# Altium project NautilusKB.PrjPcb
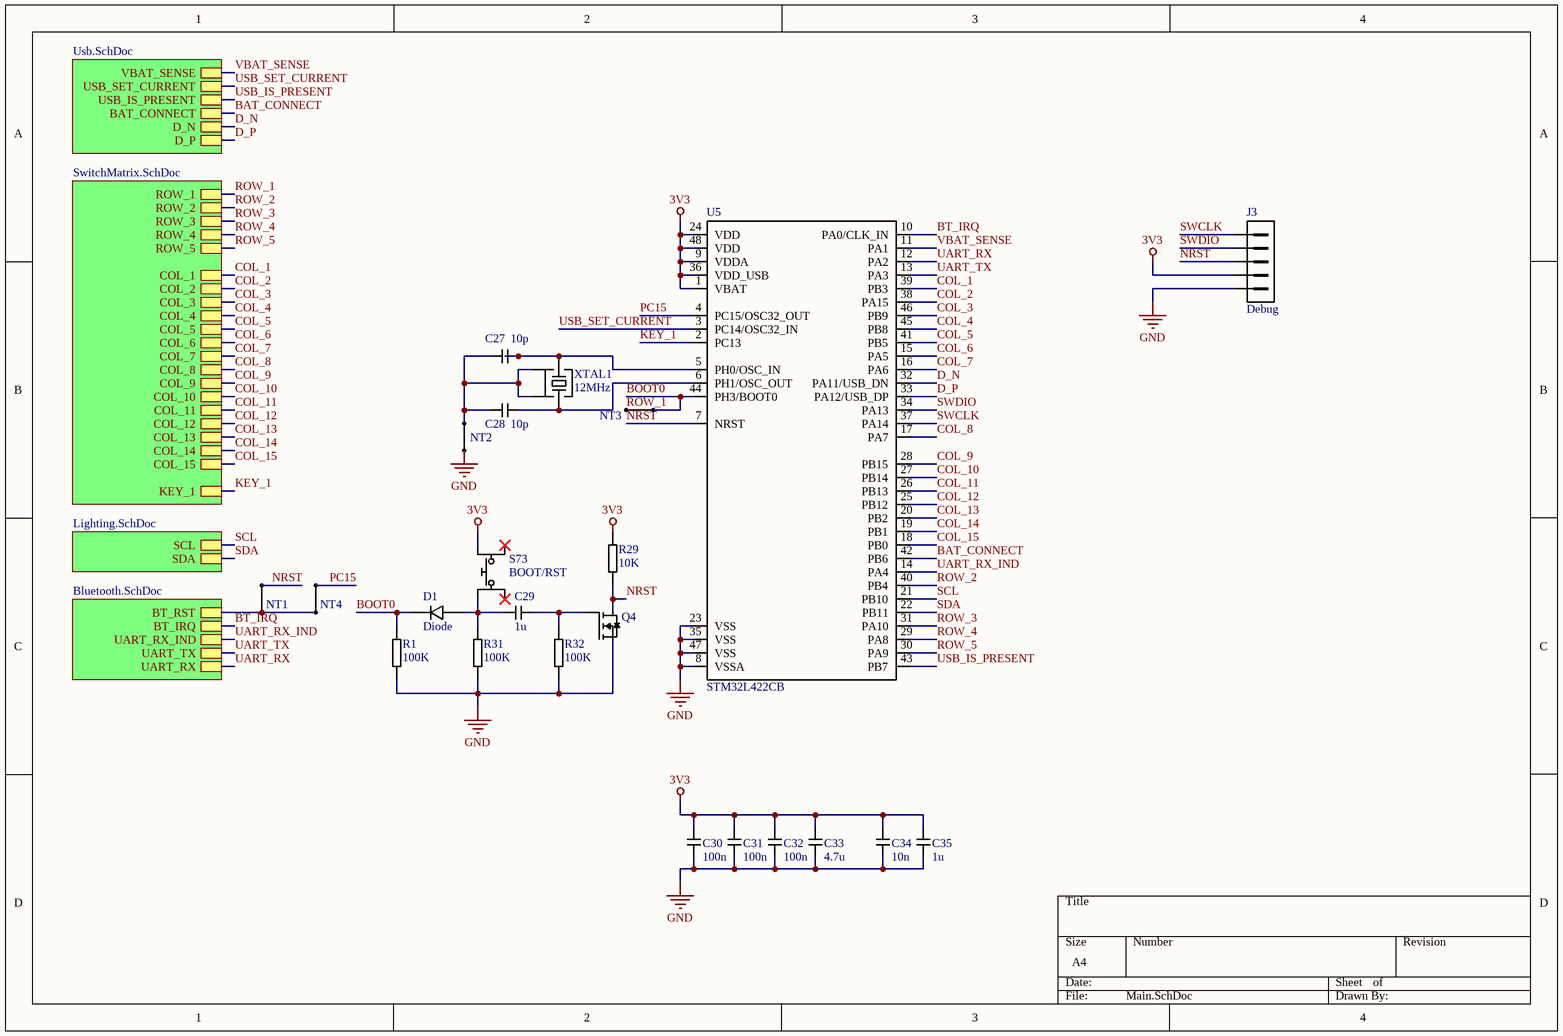
[diagram p0: Main.SchDoc]
5 sheets, 342 parts. Net scope: hierarchical (ports join the sheet entries above them; power ports are global).
Board file: PCB1.PcbDoc
Sheets:
  Main.SchDoc
    USB = Usb.SchDoc
    Switch matrix = SwitchMatrix.SchDoc
    Lighting = Lighting.SchDoc
    Bluetooth = Bluetooth.SchDoc

## Sheet Main.SchDoc
size A4

### Parts
C27  10p  [Capacitor_0603]
C28  10p  [Capacitor_0603]
C29  1u  [Capacitor_0603]
C30  100n  [Capacitor_0603]
C31  100n  [Capacitor_0603]
C32  100n  [Capacitor_0603]
C33  4.7u  [Capacitor_0603]
C34  10n  [Capacitor_0603]
C35  1u  [Capacitor_0603]
D1  Diode  [SOD_323]
J3  Debug  [Header_male_1x5_1.27mm]
NT1  Net tie  [Resistor_0603]  (value not drawn)  (net tie, no BOM)
NT2  Net tie  [Net_tie]  (value not drawn)  (net tie, no BOM)
NT3  Net tie  [Net_tie]  (value not drawn)  (net tie, no BOM)
NT4  Net tie  [Resistor_0603]  (value not drawn)  (net tie, no BOM)
Q4  NMOS  [SOT_233]  (value not drawn)
R1  100K  [Resistor_0603]
R29  10K  [Resistor_0603]
R31  100K  [Resistor_0603]
R32  100K  [Resistor_0603]
S73  BOOT/RST  [Tactile_switch_3.5x3mm_4P]
U5  STM32L422CB  [QFP_48_7mm]
XTAL1  12MHz  [Crystal_3225]

### Sub-sheets
Bluetooth = Bluetooth.SchDoc: BT_RST, BT_IRQ, UART_RX_IND, UART_TX, UART_RX
Lighting = Lighting.SchDoc: SCL, SDA
Switch matrix = SwitchMatrix.SchDoc: KEY_1, COL_15, COL_8, COL_6, ROW_3, COL_9, COL_13, COL_11, ROW_5, ROW_4, COL_12, COL_4, COL_5, COL_7, COL_3, ROW_1, COL_1, COL_14, ROW_2, COL_10, COL_2
USB = Usb.SchDoc: USB_IS_PRESENT, USB_SET_CURRENT, VBAT_SENSE, D_P, D_N, BAT_CONNECT

### Nets
3V3: C30.2 C31.2 C32.2 C33.2 C34.2 C35.2 J3.4 R29.2 S73.3 U5.1(VBAT) U5.9(VDDA) U5.24(VDD) U5.36(VDD_USB) U5.48(VDD)
GND: C30.1 C31.1 C32.1 C33.1 C34.1 C35.1 J3.5 NT2.1 Q4.2 R1.1 R31.1 R32.1 U5.8(VSSA) U5.23(VSS) U5.35(VSS) U5.47(VSS)
BAT_CONNECT: U5.42(PB6) ; sheet USB/BAT_CONNECT
BOOT0: D1.K NT3.2 R1.2 U5.44(PH3/BOOT0)
BT_IRQ: U5.10(PA0/CLK_IN) ; sheet Bluetooth/BT_IRQ
COL_1: U5.39(PB3) ; sheet Switch matrix/COL_1
COL_2: U5.38(PA15) ; sheet Switch matrix/COL_2
COL_3: U5.46(PB9) ; sheet Switch matrix/COL_3
COL_4: U5.45(PB8) ; sheet Switch matrix/COL_4
COL_5: U5.41(PB5) ; sheet Switch matrix/COL_5
COL_6: U5.15(PA5) ; sheet Switch matrix/COL_6
COL_7: U5.16(PA6) ; sheet Switch matrix/COL_7
COL_8: U5.17(PA7) ; sheet Switch matrix/COL_8
COL_9: U5.28(PB15) ; sheet Switch matrix/COL_9
COL_10: U5.27(PB14) ; sheet Switch matrix/COL_10
COL_11: U5.26(PB13) ; sheet Switch matrix/COL_11
COL_12: U5.25(PB12) ; sheet Switch matrix/COL_12
COL_13: U5.20(PB2) ; sheet Switch matrix/COL_13
COL_14: U5.19(PB1) ; sheet Switch matrix/COL_14
COL_15: U5.18(PB0) ; sheet Switch matrix/COL_15
D_N: U5.32(PA11/USB_DN) ; sheet USB/D_N
D_P: U5.33(PA12/USB_DP) ; sheet USB/D_P
KEY_1: U5.2(PC13) ; sheet Switch matrix/KEY_1
NRST: J3.3 NT1.2 Q4.3 R29.1 U5.7(NRST)
PC15: NT4.2 U5.4(PC15/OSC32_OUT)
ROW_1: NT3.1 ; sheet Switch matrix/ROW_1
ROW_2: U5.40(PB4) ; sheet Switch matrix/ROW_2
ROW_3: U5.31(PA10) ; sheet Switch matrix/ROW_3
ROW_4: U5.29(PA8) ; sheet Switch matrix/ROW_4
ROW_5: U5.30(PA9) ; sheet Switch matrix/ROW_5
SCL: U5.21(PB10) ; sheet Lighting/SCL
SDA: U5.22(PB11) ; sheet Lighting/SDA
SWCLK: J3.2 U5.37(PA14)
SWDIO: J3.1 U5.34(PA13)
UART_RX: U5.12(PA2) ; sheet Bluetooth/UART_RX
UART_RX_IND: U5.14(PA4) ; sheet Bluetooth/UART_RX_IND
UART_TX: U5.13(PA3) ; sheet Bluetooth/UART_TX
USB_IS_PRESENT: U5.43(PB7) ; sheet USB/USB_IS_PRESENT
USB_SET_CURRENT: U5.3(PC14/OSC32_IN) ; sheet USB/USB_SET_CURRENT
VBAT_SENSE: U5.11(PA1) ; sheet USB/VBAT_SENSE
NetC27_1: C27.1 C28.1 NT2.2 XTAL1.2 XTAL1.4
NetC27_2: C27.2 U5.5(PH0/OSC_IN) XTAL1.1
NetC28_2: C28.2 U5.6(PH1/OSC_OUT) XTAL1.3
NetC29_1: C29.1 D1.A R31.2 S73.1
NetC29_2: C29.2 Q4.1 R32.2
NetNT1_1: NT1.1 NT4.1 ; sheet Bluetooth/BT_RST

Not connected (* = marked no-connect by the designer): S73 2* 4*

### Library data of the parts
C27-C35 = Capacitor
J3 = Connector_5P
R1 R29 R31 R32 = Resistor
S73 = Pushbutton_4P
XTAL1 = Crystal_4P

## Sheet Usb.SchDoc
size A4
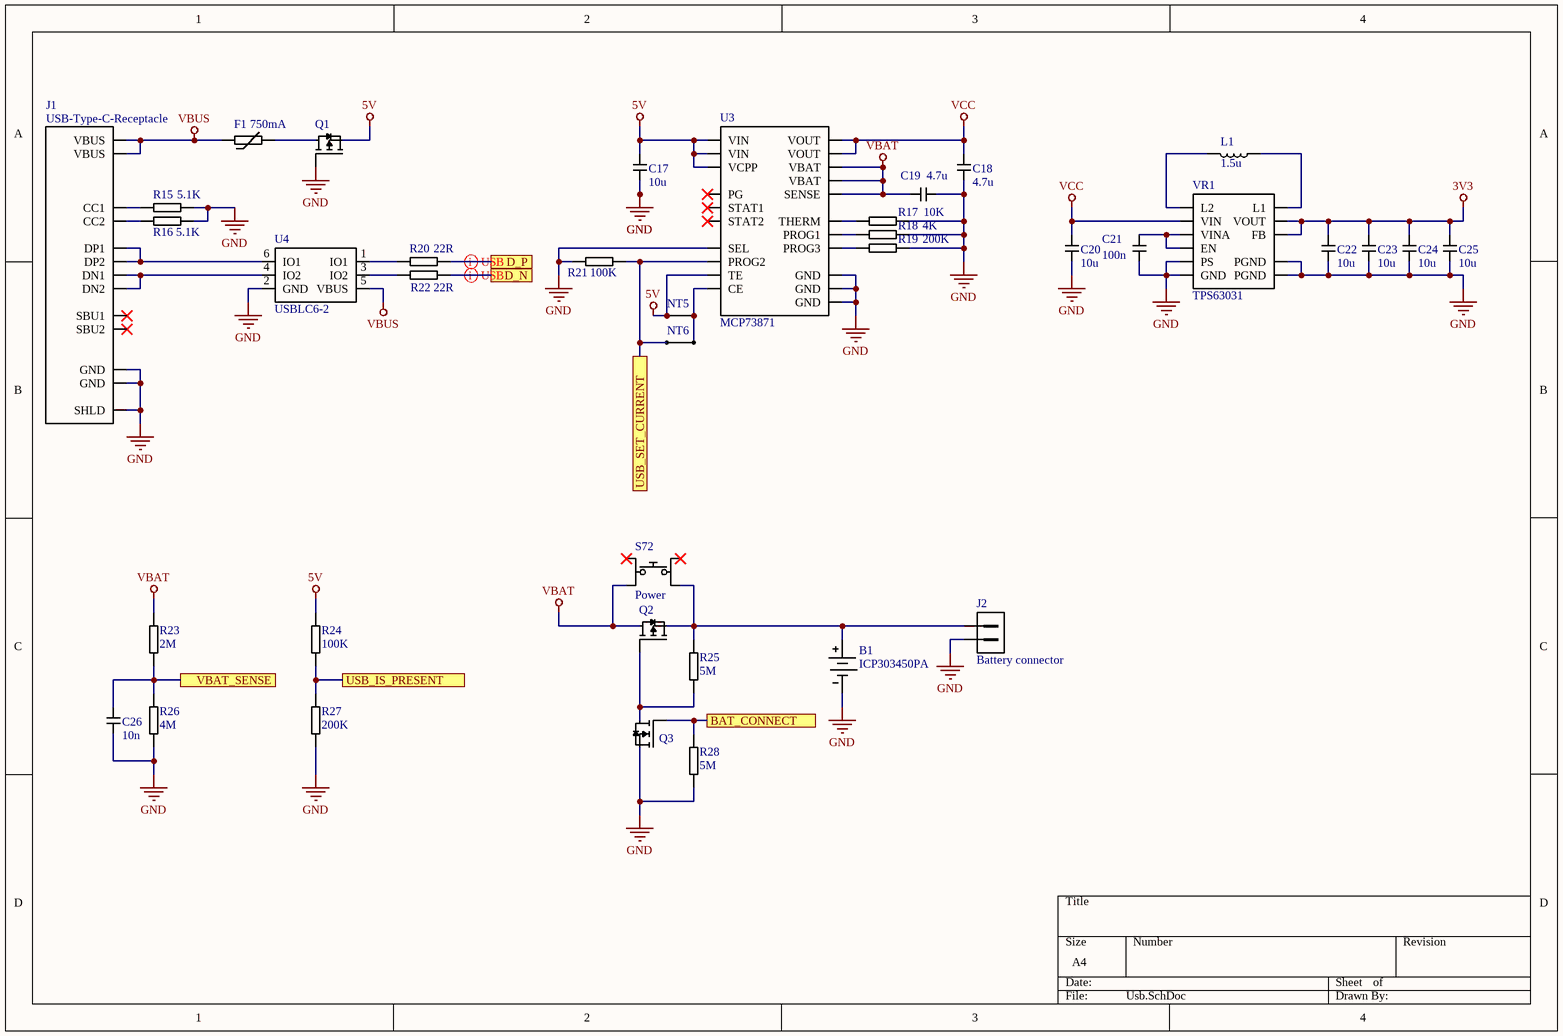
[diagram p1: Usb.SchDoc]

### Parts
B1  ICP303450PA  (mechanical)
C17  10u  [Capacitor_0603]
C18  4.7u  [Capacitor_0603]
C19  4.7u  [Capacitor_0603]
C20  10u  [Capacitor_0603]
C21  100n  [Capacitor_0603]
C22  10u  [Capacitor_0603]
C23  10u  [Capacitor_0603]
C24  10u  [Capacitor_0603]
C25  10u  [Capacitor_0603]
C26  10n  [Capacitor_0603]
F1  750mA  [Resistor_0805]
J1  USB-Type-C-Receptacle  [TYPE_C_31_M_12]
J2  Battery connector  [JST_SH_2P_Female]
L1  1.5u  [Inductor_3015]
NT5  Net tie  [Resistor_0603]  (value not drawn)  (net tie, no BOM)
NT6  Net tie  [Resistor_0603]  (value not drawn)  (net tie, no BOM)
Q1  PMOS  [SOT_233]  (value not drawn)
Q2  PMOS  [SOT_233]  (value not drawn)
Q3  NMOS  [SOT_233]  (value not drawn)
R15  5.1K  [Resistor_0603]
R16  5.1K  [Resistor_0603]
R17  10K  [Resistor_0603]
R18  4K  [Resistor_0603]
R19  200K  [Resistor_0603]
R20  22R  [Resistor_0603]
R21  100K  [Resistor_0603]
R22  22R  [Resistor_0603]
R23  2M  [Resistor_0603]
R24  100K  [Resistor_0603]
R25  5M  [Resistor_0603]
R26  4M  [Resistor_0603]
R27  200K  [Resistor_0603]
R28  5M  [Resistor_0603]
S72  Power  [Tactile_switch_5.1x5.1mm_4P]
U3  MCP73871  [QFN_20_4mm]
U4  USBLC6-2  [SOT_666]
VR1  TPS63031  [WSON_10_2.6mm]

### Ports
BAT_CONNECT, D_N, D_P, USB_IS_PRESENT, USB_SET_CURRENT, VBAT_SENSE

### Nets
3V3: C22.2 C23.2 C24.2 C25.2 VR1.1(VOUT) VR1.10(FB)
5V: C17.2 NT5.1 Q1.2 R24.2 U3.2(VCPP) U3.9(TE) U3.18(VIN) U3.19(VIN)
GND: B1.2 C17.1 C18.1 C19.2 C20.1 C21.1 C22.1 C23.1 C24.1 C25.1 C26.1 J1.A1(GND) J1.B1(GND) J1.SHLD J2.2 Q1.1 Q3.2 R15.2 R16.2 R17.2 R18.2 R19.2 R21.1 R26.1 R27.1 R28.1 U3.3(SEL) U3.10(GND) U3.11(GND) U3.21(GND) U4.2(GND) VR1.3(PGND) VR1.7(PS) VR1.9(GND) VR1.11(PGND)
VBAT: C19.1 Q2.3 R23.2 S72.4 U3.14(VBAT) U3.15(VBAT) U3.16(SENSE)
VBUS: F1.1 J1.A4(VBUS) J1.B4(VBUS) U4.5(VBUS)
VCC: C18.2 C20.2 U3.1(VOUT) U3.20(VOUT) VR1.5(VIN)
BAT_CONNECT: Q3.1 R28.2 ; port BAT_CONNECT
D_N: R22.2 ; port D_N
D_P: R20.2 ; port D_P
USB_IS_PRESENT: R24.1 R27.2 ; port USB_IS_PRESENT
USB_SET_CURRENT: NT6.1 R21.2 U3.4(PROG2) ; port USB_SET_CURRENT
VBAT_SENSE: C26.2 R23.1 R26.2 ; port VBAT_SENSE
NetB1_1: B1.1 J2.1 Q2.2 R25.2 S72.2
NetC21_2: C21.2 VR1.6(EN) VR1.8(VINA)
NetF1_2: F1.2 Q1.3
NetJ1_A5: J1.A5(CC1) R15.1
NetJ1_A6: J1.A6(DP1) J1.B6(DP2) U4.6(IO1)
NetJ1_A7: J1.A7(DN1) J1.B7(DN2) U4.4(IO2)
NetJ1_B5: J1.B5(CC2) R16.1
NetL1_1: L1.1 VR1.2(L2)
NetL1_2: L1.2 VR1.4(L1)
NetNT5_2: NT5.2 NT6.2 U3.17(CE)
NetQ2_1: Q2.1 Q3.3 R25.1
NetR17_1: R17.1 U3.5(THERM)
NetR18_1: R18.1 U3.13(PROG1)
NetR19_1: R19.1 U3.12(PROG3)
NetR20_1: R20.1 U4.1(IO1)
NetR22_1: R22.1 U4.3(IO2)

Not connected (* = marked no-connect by the designer): J1 A8(SBU1)* B8(SBU2)*; S72 1* 3*; U3 6(PG)* 7(STAT2)* 8(STAT1)*

### Layout directives
differential pair: D_N, D_P

### Notes on the sheet
- Prog1 sets max. charge current
  Prog3 sets termination point
  R(KOhm)=1000(V)/I(mA)

### Library data of the parts
B1 = Battery
C17-C26 = Capacitor
F1 = Fuse
J2 = Connector_2P
L1 = Inductor
R15-R28 = Resistor
S72 = Pushbutton_4P

## Sheet SwitchMatrix.SchDoc
size A4
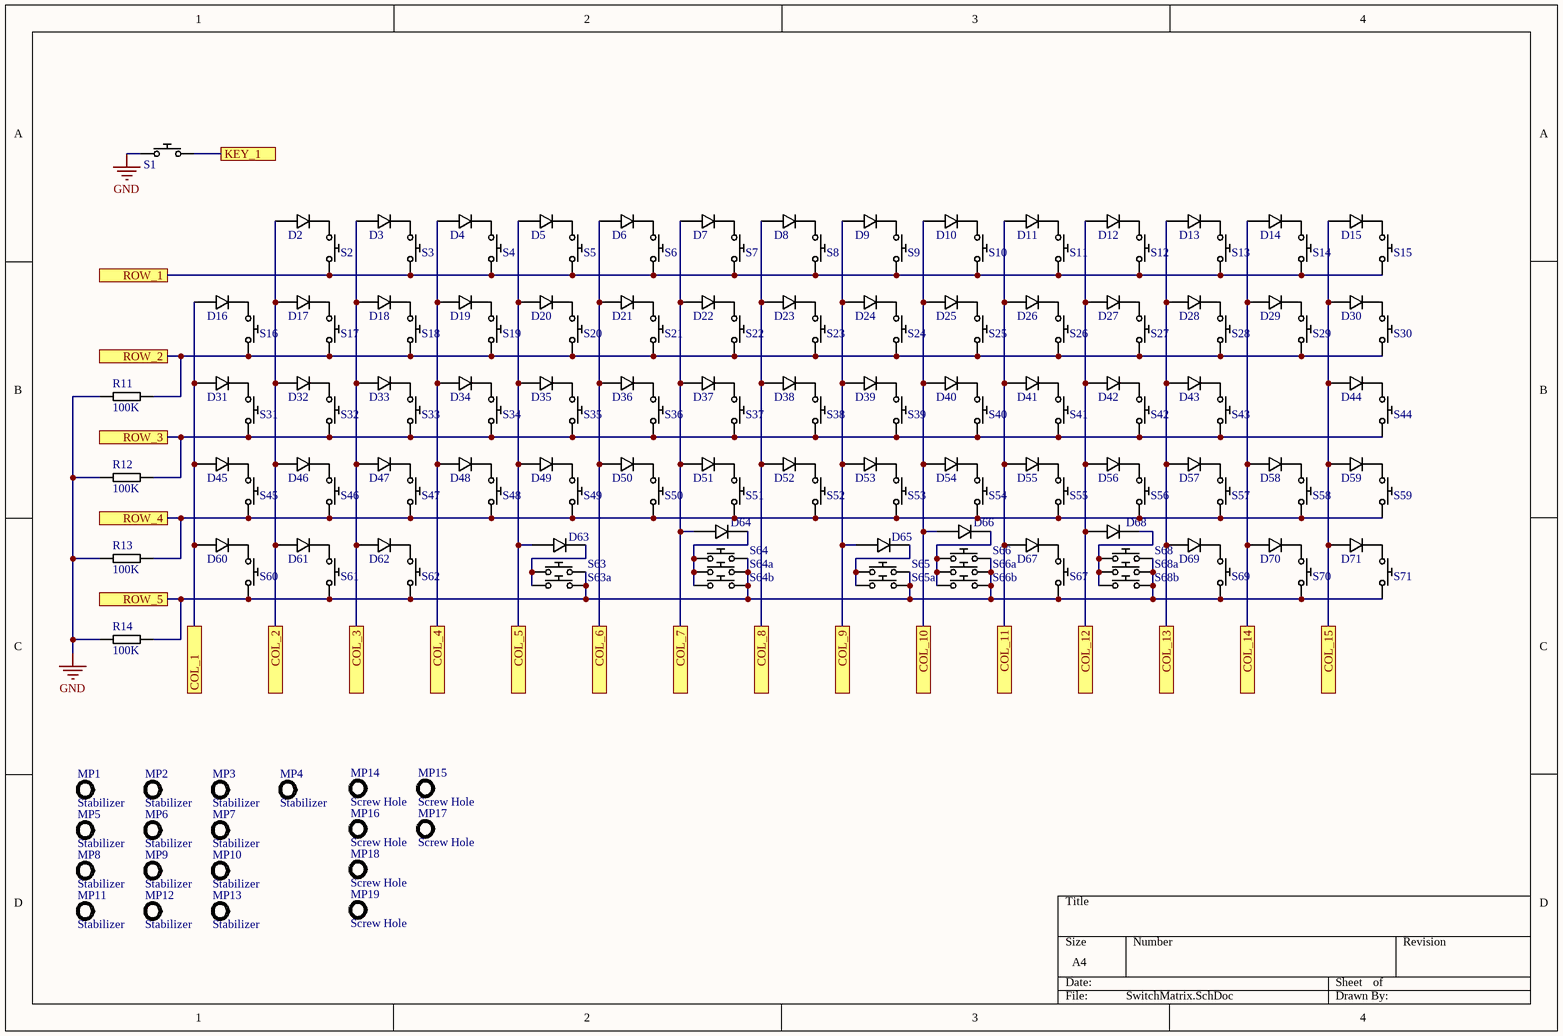
[diagram p2: SwitchMatrix.SchDoc]

### Parts
D2  Diode  [SOD_323]  (value not drawn)
D3  Diode  [SOD_323]  (value not drawn)
D4  Diode  [SOD_323]  (value not drawn)
D5  Diode  [SOD_323]  (value not drawn)
D6  Diode  [SOD_323]  (value not drawn)
D7  Diode  [SOD_323]  (value not drawn)
D8  Diode  [SOD_323]  (value not drawn)
D9  Diode  [SOD_323]  (value not drawn)
D10  Diode  [SOD_323]  (value not drawn)
D11  Diode  [SOD_323]  (value not drawn)
D12  Diode  [SOD_323]  (value not drawn)
D13  Diode  [SOD_323]  (value not drawn)
D14  Diode  [SOD_323]  (value not drawn)
D15  Diode  [SOD_323]  (value not drawn)
D16  Diode  [SOD_323]  (value not drawn)
D17  Diode  [SOD_323]  (value not drawn)
D18  Diode  [SOD_323]  (value not drawn)
D19  Diode  [SOD_323]  (value not drawn)
D20  Diode  [SOD_323]  (value not drawn)
D21  Diode  [SOD_323]  (value not drawn)
D22  Diode  [SOD_323]  (value not drawn)
D23  Diode  [SOD_323]  (value not drawn)
D24  Diode  [SOD_323]  (value not drawn)
D25  Diode  [SOD_323]  (value not drawn)
D26  Diode  [SOD_323]  (value not drawn)
D27  Diode  [SOD_323]  (value not drawn)
D28  Diode  [SOD_323]  (value not drawn)
D29  Diode  [SOD_323]  (value not drawn)
D30  Diode  [SOD_323]  (value not drawn)
D31  Diode  [SOD_323]  (value not drawn)
D32  Diode  [SOD_323]  (value not drawn)
D33  Diode  [SOD_323]  (value not drawn)
D34  Diode  [SOD_323]  (value not drawn)
D35  Diode  [SOD_323]  (value not drawn)
D36  Diode  [SOD_323]  (value not drawn)
D37  Diode  [SOD_323]  (value not drawn)
D38  Diode  [SOD_323]  (value not drawn)
D39  Diode  [SOD_323]  (value not drawn)
D40  Diode  [SOD_323]  (value not drawn)
D41  Diode  [SOD_323]  (value not drawn)
D42  Diode  [SOD_323]  (value not drawn)
D43  Diode  [SOD_323]  (value not drawn)
D44  Diode  [SOD_323]  (value not drawn)
D45  Diode  [SOD_323]  (value not drawn)
D46  Diode  [SOD_323]  (value not drawn)
D47  Diode  [SOD_323]  (value not drawn)
D48  Diode  [SOD_323]  (value not drawn)
D49  Diode  [SOD_323]  (value not drawn)
D50  Diode  [SOD_323]  (value not drawn)
D51  Diode  [SOD_323]  (value not drawn)
D52  Diode  [SOD_323]  (value not drawn)
D53  Diode  [SOD_323]  (value not drawn)
D54  Diode  [SOD_323]  (value not drawn)
D55  Diode  [SOD_323]  (value not drawn)
D56  Diode  [SOD_323]  (value not drawn)
D57  Diode  [SOD_323]  (value not drawn)
D58  Diode  [SOD_323]  (value not drawn)
D59  Diode  [SOD_323]  (value not drawn)
D60  Diode  [SOD_323]  (value not drawn)
D61  Diode  [SOD_323]  (value not drawn)
D62  Diode  [SOD_323]  (value not drawn)
D63  Diode  [SOD_323]  (value not drawn)
D64  Diode  [SOD_323]  (value not drawn)
D65  Diode  [SOD_323]  (value not drawn)
D66  Diode  [SOD_323]  (value not drawn)
D67  Diode  [SOD_323]  (value not drawn)
D68  Diode  [SOD_323]  (value not drawn)
D69  Diode  [SOD_323]  (value not drawn)
D70  Diode  [SOD_323]  (value not drawn)
D71  Diode  [SOD_323]  (value not drawn)
MP1  Stabilizer  [Cherry_stabilizer]
MP2  Stabilizer  [Cherry_stabilizer]
MP3  Stabilizer  [Cherry_stabilizer]
MP4  Stabilizer  [Cherry_stabilizer]
MP5  Stabilizer  [Cherry_stabilizer]
MP6  Stabilizer  [Cherry_stabilizer]
MP7  Stabilizer  [Cherry_stabilizer]
MP8  Stabilizer  [Cherry_stabilizer]
MP9  Stabilizer  [Cherry_stabilizer]
MP10  Stabilizer  [Cherry_stabilizer]
MP11  Stabilizer  [Cherry_stabilizer]
MP12  Stabilizer  [Cherry_stabilizer]
MP13  Stabilizer  [Cherry_stabilizer]
MP14  Screw Hole  [Slot_2.2x5mm]
MP15  Screw Hole  [Slot_2.2x5mm]
MP16  Screw Hole  [Slot_2.2x5mm]
MP17  Screw Hole  [Slot_2.2x5mm]
MP18  Screw Hole  [Slot_2.2x5mm]
MP19  Screw Hole  [Slot_2.2x5mm]
R11  100K  [Resistor_0603]
R12  100K  [Resistor_0603]
R13  100K  [Resistor_0603]
R14  100K  [Resistor_0603]
S1  Pushbutton_2P  [CherryMX_PCB_RGB]  (value not drawn)
S2  Pushbutton_2P  [CherryMX_PCB_RGB]  (value not drawn)
S3  Pushbutton_2P  [CherryMX_PCB_RGB]  (value not drawn)
S4  Pushbutton_2P  [CherryMX_PCB_RGB]  (value not drawn)
S5  Pushbutton_2P  [CherryMX_PCB_RGB]  (value not drawn)
S6  Pushbutton_2P  [CherryMX_PCB_RGB]  (value not drawn)
S7  Pushbutton_2P  [CherryMX_PCB_RGB]  (value not drawn)
S8  Pushbutton_2P  [CherryMX_PCB_RGB]  (value not drawn)
S9  Pushbutton_2P  [CherryMX_PCB_RGB]  (value not drawn)
S10  Pushbutton_2P  [CherryMX_PCB_RGB]  (value not drawn)
S11  Pushbutton_2P  [CherryMX_PCB_RGB]  (value not drawn)
S12  Pushbutton_2P  [CherryMX_PCB_RGB]  (value not drawn)
S13  Pushbutton_2P  [CherryMX_PCB_RGB]  (value not drawn)
S14  Pushbutton_2P  [CherryMX_PCB_RGB]  (value not drawn)
S15  Pushbutton_2P  [CherryMX_PCB_RGB]  (value not drawn)
S16  Pushbutton_2P  [CherryMX_PCB_RGB]  (value not drawn)
S17  Pushbutton_2P  [CherryMX_PCB_RGB]  (value not drawn)
S18  Pushbutton_2P  [CherryMX_PCB_RGB]  (value not drawn)
S19  Pushbutton_2P  [CherryMX_PCB_RGB]  (value not drawn)
S20  Pushbutton_2P  [CherryMX_PCB_RGB]  (value not drawn)
S21  Pushbutton_2P  [CherryMX_PCB_RGB]  (value not drawn)
S22  Pushbutton_2P  [CherryMX_PCB_RGB]  (value not drawn)
S23  Pushbutton_2P  [CherryMX_PCB_RGB]  (value not drawn)
S24  Pushbutton_2P  [CherryMX_PCB_RGB]  (value not drawn)
S25  Pushbutton_2P  [CherryMX_PCB_RGB]  (value not drawn)
S26  Pushbutton_2P  [CherryMX_PCB_RGB]  (value not drawn)
S27  Pushbutton_2P  [CherryMX_PCB_RGB]  (value not drawn)
S28  Pushbutton_2P  [CherryMX_PCB_RGB]  (value not drawn)
S29  Pushbutton_2P  [CherryMX_PCB_RGB]  (value not drawn)
S30  Pushbutton_2P  [CherryMX_PCB_RGB]  (value not drawn)
S31  Pushbutton_2P  [CherryMX_PCB_RGB]  (value not drawn)
S32  Pushbutton_2P  [CherryMX_PCB_RGB]  (value not drawn)
S33  Pushbutton_2P  [CherryMX_PCB_RGB]  (value not drawn)
S34  Pushbutton_2P  [CherryMX_PCB_RGB]  (value not drawn)
S35  Pushbutton_2P  [CherryMX_PCB_RGB]  (value not drawn)
S36  Pushbutton_2P  [CherryMX_PCB_RGB]  (value not drawn)
S37  Pushbutton_2P  [CherryMX_PCB_RGB]  (value not drawn)
S38  Pushbutton_2P  [CherryMX_PCB_RGB]  (value not drawn)
S39  Pushbutton_2P  [CherryMX_PCB_RGB]  (value not drawn)
S40  Pushbutton_2P  [CherryMX_PCB_RGB]  (value not drawn)
S41  Pushbutton_2P  [CherryMX_PCB_RGB]  (value not drawn)
S42  Pushbutton_2P  [CherryMX_PCB_RGB]  (value not drawn)
S43  Pushbutton_2P  [CherryMX_PCB_RGB]  (value not drawn)
S44  Pushbutton_2P  [CherryMX_PCB_RGB]  (value not drawn)
S45  Pushbutton_2P  [CherryMX_PCB_RGB]  (value not drawn)
S46  Pushbutton_2P  [CherryMX_PCB_RGB]  (value not drawn)
S47  Pushbutton_2P  [CherryMX_PCB_RGB]  (value not drawn)
S48  Pushbutton_2P  [CherryMX_PCB_RGB]  (value not drawn)
S49  Pushbutton_2P  [CherryMX_PCB_RGB]  (value not drawn)
S50  Pushbutton_2P  [CherryMX_PCB_RGB]  (value not drawn)
S51  Pushbutton_2P  [CherryMX_PCB_RGB]  (value not drawn)
S52  Pushbutton_2P  [CherryMX_PCB_RGB]  (value not drawn)
S53  Pushbutton_2P  [CherryMX_PCB_RGB]  (value not drawn)
S54  Pushbutton_2P  [CherryMX_PCB_RGB]  (value not drawn)
S55  Pushbutton_2P  [CherryMX_PCB_RGB]  (value not drawn)
S56  Pushbutton_2P  [CherryMX_PCB_RGB]  (value not drawn)
S57  Pushbutton_2P  [CherryMX_PCB_RGB]  (value not drawn)
S58  Pushbutton_2P  [CherryMX_PCB_RGB]  (value not drawn)
S59  Pushbutton_2P  [CherryMX_PCB_RGB]  (value not drawn)
S60  Pushbutton_2P  [CherryMX_PCB_RGB]  (value not drawn)
S61  Pushbutton_2P  [CherryMX_PCB_RGB]  (value not drawn)
S62  Pushbutton_2P  [CherryMX_PCB_RGB]  (value not drawn)
S63  Pushbutton_2P  [CherryMX_PCB_RGB]  (value not drawn)
S63a  Pushbutton_2P  [CherryMX_PCB_RGB]  (value not drawn)
S64  Pushbutton_2P  [CherryMX_PCB_RGB]  (value not drawn)
S64a  Comment  [CherryMX_PCB_RGB]  (value not drawn)
S64b  Comment  [CherryMX_PCB_RGB]  (value not drawn)
S65  Pushbutton_2P  [CherryMX_PCB_RGB]  (value not drawn)
S65a  Comment  [CherryMX_PCB_RGB]  (value not drawn)
S66  Pushbutton_2P  [CherryMX_PCB_RGB]  (value not drawn)
S66a  Comment  [CherryMX_PCB_RGB]  (value not drawn)
S66b  Comment  [CherryMX_PCB_RGB]  (value not drawn)
S67  Comment  [CherryMX_PCB_RGB]  (value not drawn)
S68  Pushbutton_2P  [CherryMX_PCB_RGB]  (value not drawn)
S68a  Comment  [CherryMX_PCB_RGB]  (value not drawn)
S68b  Comment  [CherryMX_PCB_RGB]  (value not drawn)
S69  Pushbutton_2P  [CherryMX_PCB_RGB]  (value not drawn)
S70  Pushbutton_2P  [CherryMX_PCB_RGB]  (value not drawn)
S71  Pushbutton_2P  [CherryMX_PCB_RGB]  (value not drawn)

### Ports
COL_1, COL_2, COL_3, COL_4, COL_5, COL_6, COL_7, COL_8, COL_9, COL_10, COL_11, COL_12, COL_13, COL_14, COL_15, KEY_1, ROW_1, ROW_2, ROW_3, ROW_4, ROW_5

### Nets
GND: R11.1 R12.1 R13.1 R14.1 S1.1
COL_1: D16.A D31.A D45.A D60.A ; port COL_1
COL_2: D2.A D17.A D32.A D46.A D61.A ; port COL_2
COL_3: D3.A D18.A D33.A D47.A D62.A ; port COL_3
COL_4: D4.A D19.A D34.A D48.A ; port COL_4
COL_5: D5.A D20.A D35.A D49.A D63.A ; port COL_5
COL_6: D6.A D21.A D36.A D50.A ; port COL_6
COL_7: D7.A D22.A D37.A D51.A D64.A ; port COL_7
COL_8: D8.A D23.A D38.A D52.A ; port COL_8
COL_9: D9.A D24.A D39.A D53.A D65.A ; port COL_9
COL_10: D10.A D25.A D40.A D54.A D66.A ; port COL_10
COL_11: D11.A D26.A D41.A D55.A D67.A ; port COL_11
COL_12: D12.A D27.A D42.A D56.A D68.A ; port COL_12
COL_13: D13.A D28.A D43.A D57.A D69.A ; port COL_13
COL_14: D14.A D29.A D58.A D70.A ; port COL_14
COL_15: D15.A D30.A D44.A D59.A D71.A ; port COL_15
KEY_1: S1.2 ; port KEY_1
ROW_1: S2.2 S3.2 S4.2 S5.2 S6.2 S7.2 S8.2 S9.2 S10.2 S11.2 S12.2 S13.2 S14.2 S15.2 ; port ROW_1
ROW_2: R11.2 S16.2 S17.2 S18.2 S19.2 S20.2 S21.2 S22.2 S23.2 S24.2 S25.2 S26.2 S27.2 S28.2 S29.2 S30.2 ; port ROW_2
ROW_3: R12.2 S31.2 S32.2 S33.2 S34.2 S35.2 S36.2 S37.2 S38.2 S39.2 S40.2 S41.2 S42.2 S43.2 S44.2 ; port ROW_3
ROW_4: R13.2 S45.2 S46.2 S47.2 S48.2 S49.2 S50.2 S51.2 S52.2 S53.2 S54.2 S55.2 S56.2 S57.2 S58.2 S59.2 ; port ROW_4
ROW_5: R14.2 S60.2 S61.2 S62.2 S63.2 S63a.2 S64.2 S64a.2 S64b.2 S65.2 S65a.2 S66.2 S66a.2 S66b.2 S67.2 S68.2 S68a.2 S68b.2 S69.2 S70.2 S71.2 ; port ROW_5
NetD2_K: D2.K S2.1
NetD3_K: D3.K S3.1
NetD4_K: D4.K S4.1
NetD5_K: D5.K S5.1
NetD6_K: D6.K S6.1
NetD7_K: D7.K S7.1
NetD8_K: D8.K S8.1
NetD9_K: D9.K S9.1
NetD10_K: D10.K S10.1
NetD11_K: D11.K S11.1
NetD12_K: D12.K S12.1
NetD13_K: D13.K S13.1
NetD14_K: D14.K S14.1
NetD15_K: D15.K S15.1
NetD16_K: D16.K S16.1
NetD17_K: D17.K S17.1
NetD18_K: D18.K S18.1
NetD19_K: D19.K S19.1
NetD20_K: D20.K S20.1
NetD21_K: D21.K S21.1
NetD22_K: D22.K S22.1
NetD23_K: D23.K S23.1
NetD24_K: D24.K S24.1
NetD25_K: D25.K S25.1
NetD26_K: D26.K S26.1
NetD27_K: D27.K S27.1
NetD28_K: D28.K S28.1
NetD29_K: D29.K S29.1
NetD30_K: D30.K S30.1
NetD31_K: D31.K S31.1
NetD32_K: D32.K S32.1
NetD33_K: D33.K S33.1
NetD34_K: D34.K S34.1
NetD35_K: D35.K S35.1
NetD36_K: D36.K S36.1
NetD37_K: D37.K S37.1
NetD38_K: D38.K S38.1
NetD39_K: D39.K S39.1
NetD40_K: D40.K S40.1
NetD41_K: D41.K S41.1
NetD42_K: D42.K S42.1
NetD43_K: D43.K S43.1
NetD44_K: D44.K S44.1
NetD45_K: D45.K S45.1
NetD46_K: D46.K S46.1
NetD47_K: D47.K S47.1
NetD48_K: D48.K S48.1
NetD49_K: D49.K S49.1
NetD50_K: D50.K S50.1
NetD51_K: D51.K S51.1
NetD52_K: D52.K S52.1
NetD53_K: D53.K S53.1
NetD54_K: D54.K S54.1
NetD55_K: D55.K S55.1
NetD56_K: D56.K S56.1
NetD57_K: D57.K S57.1
NetD58_K: D58.K S58.1
NetD59_K: D59.K S59.1
NetD60_K: D60.K S60.1
NetD61_K: D61.K S61.1
NetD62_K: D62.K S62.1
NetD63_K: D63.K S63.1 S63a.1
NetD64_K: D64.K S64.1 S64a.1 S64b.1
NetD65_K: D65.K S65.1 S65a.1
NetD66_K: D66.K S66.1 S66a.1 S66b.1
NetD67_K: D67.K S67.1
NetD68_K: D68.K S68.1 S68a.1 S68b.1
NetD69_K: D69.K S69.1
NetD70_K: D70.K S70.1
NetD71_K: D71.K S71.1

### Library data of the parts
MP1-MP13 = Cherry_Stabilizer
MP14-MP19 = Mechanical_part
R11-R14 = Resistor
S64a S64b S65a S66a S66b S67 S68a S68b = Pushbutton_2P

## Sheet Lighting.SchDoc
size A4
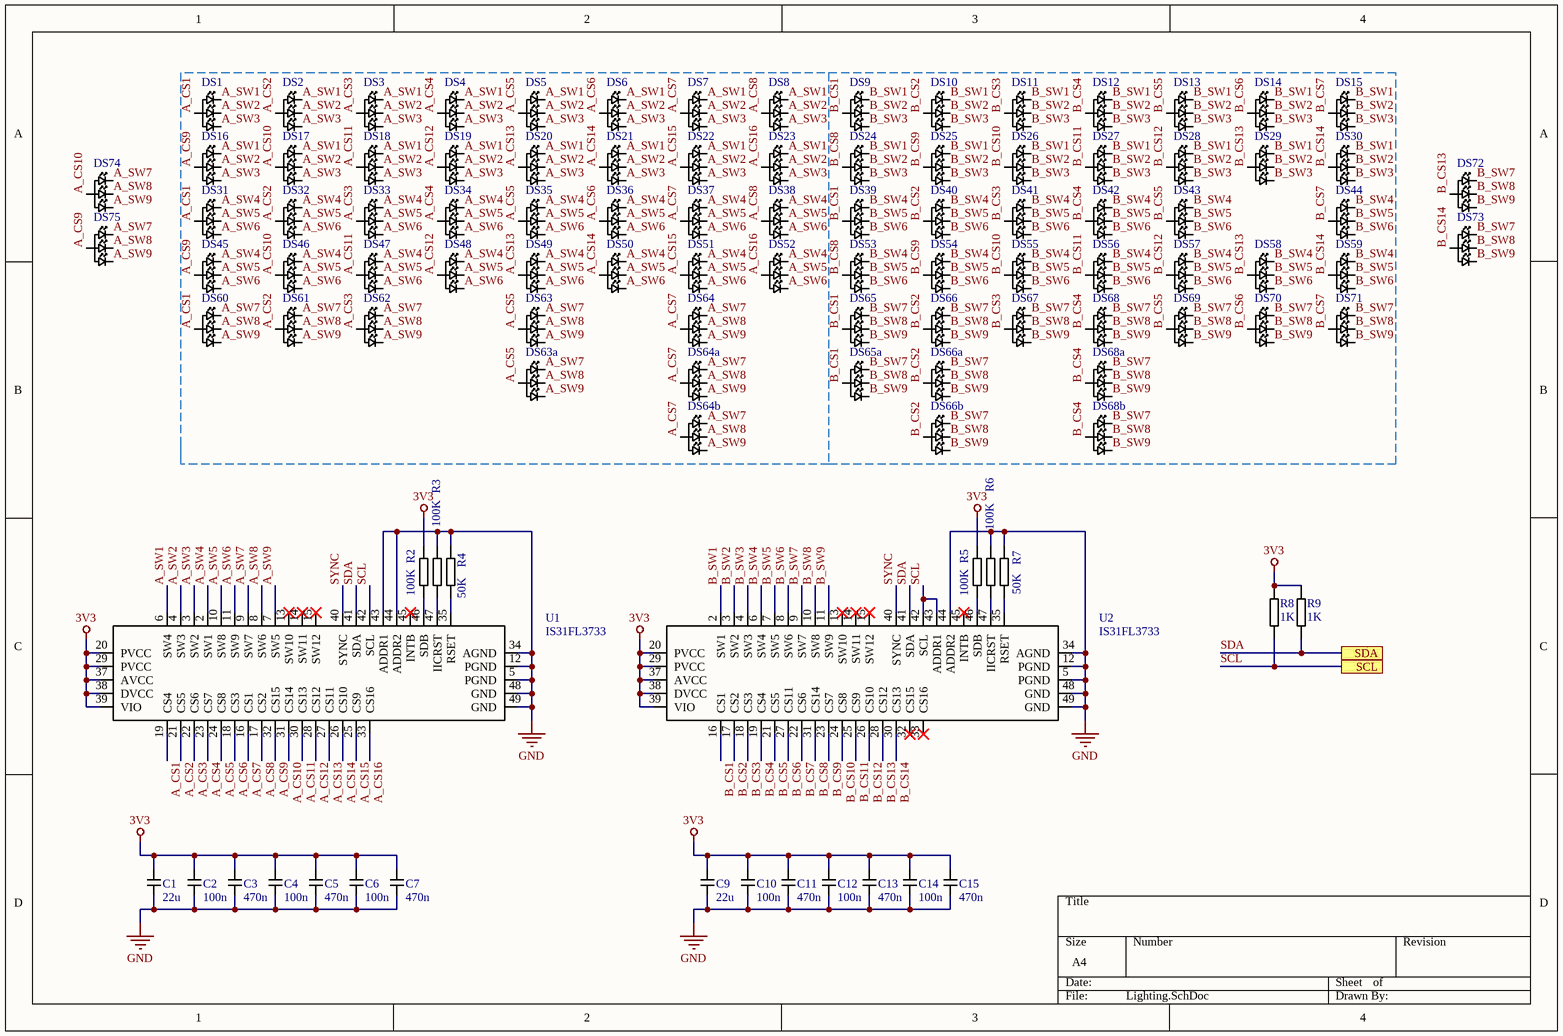
[diagram p3: Lighting.SchDoc]

### Parts
C1  22u  [Capacitor_0603]
C2  100n  [Capacitor_0603]
C3  470n  [Capacitor_0603]
C4  100n  [Capacitor_0603]
C5  470n  [Capacitor_0603]
C6  100n  [Capacitor_0603]
C7  470n  [Capacitor_0603]
C9  22u  [Capacitor_0603]
C10  100n  [Capacitor_0603]
C11  470n  [Capacitor_0603]
C12  100n  [Capacitor_0603]
C13  470n  [Capacitor_0603]
C14  100n  [Capacitor_0603]
C15  470n  [Capacitor_0603]
DS1  RGB_CA  [LED_1616_4P]  (value not drawn)
DS2  RGB_CA  [LED_1616_4P]  (value not drawn)
DS3  RGB_CA  [LED_1616_4P]  (value not drawn)
DS4  RGB_CA  [LED_1616_4P]  (value not drawn)
DS5  RGB_CA  [LED_1616_4P]  (value not drawn)
DS6  RGB_CA  [LED_1616_4P]  (value not drawn)
DS7  RGB_CA  [LED_1616_4P]  (value not drawn)
DS8  RGB_CA  [LED_1616_4P]  (value not drawn)
DS9  RGB_CA  [LED_1616_4P]  (value not drawn)
DS10  RGB_CA  [LED_1616_4P]  (value not drawn)
DS11  RGB_CA  [LED_1616_4P]  (value not drawn)
DS12  RGB_CA  [LED_1616_4P]  (value not drawn)
DS13  RGB_CA  [LED_1616_4P]  (value not drawn)
DS14  RGB_CA  [LED_1616_4P]  (value not drawn)
DS15  RGB_CA  [LED_1616_4P]  (value not drawn)
DS16  RGB_CA  [LED_1616_4P]  (value not drawn)
DS17  RGB_CA  [LED_1616_4P]  (value not drawn)
DS18  RGB_CA  [LED_1616_4P]  (value not drawn)
DS19  RGB_CA  [LED_1616_4P]  (value not drawn)
DS20  RGB_CA  [LED_1616_4P]  (value not drawn)
DS21  RGB_CA  [LED_1616_4P]  (value not drawn)
DS22  RGB_CA  [LED_1616_4P]  (value not drawn)
DS23  RGB_CA  [LED_1616_4P]  (value not drawn)
DS24  RGB_CA  [LED_1616_4P]  (value not drawn)
DS25  RGB_CA  [LED_1616_4P]  (value not drawn)
DS26  RGB_CA  [LED_1616_4P]  (value not drawn)
DS27  RGB_CA  [LED_1616_4P]  (value not drawn)
DS28  RGB_CA  [LED_1616_4P]  (value not drawn)
DS29  RGB_CA  [LED_1616_4P]  (value not drawn)
DS30  RGB_CA  [LED_1616_4P]  (value not drawn)
DS31  RGB_CA  [LED_1616_4P]  (value not drawn)
DS32  RGB_CA  [LED_1616_4P]  (value not drawn)
DS33  RGB_CA  [LED_1616_4P]  (value not drawn)
DS34  RGB_CA  [LED_1616_4P]  (value not drawn)
DS35  RGB_CA  [LED_1616_4P]  (value not drawn)
DS36  RGB_CA  [LED_1616_4P]  (value not drawn)
DS37  RGB_CA  [LED_1616_4P]  (value not drawn)
DS38  RGB_CA  [LED_1616_4P]  (value not drawn)
DS39  RGB_CA  [LED_1616_4P]  (value not drawn)
DS40  RGB_CA  [LED_1616_4P]  (value not drawn)
DS41  RGB_CA  [LED_1616_4P]  (value not drawn)
DS42  RGB_CA  [LED_1616_4P]  (value not drawn)
DS43  RGB_CA  [LED_1616_4P]  (value not drawn)
DS44  RGB_CA  [LED_1616_4P]  (value not drawn)
DS45  RGB_CA  [LED_1616_4P]  (value not drawn)
DS46  RGB_CA  [LED_1616_4P]  (value not drawn)
DS47  RGB_CA  [LED_1616_4P]  (value not drawn)
DS48  RGB_CA  [LED_1616_4P]  (value not drawn)
DS49  RGB_CA  [LED_1616_4P]  (value not drawn)
DS50  RGB_CA  [LED_1616_4P]  (value not drawn)
DS51  RGB_CA  [LED_1616_4P]  (value not drawn)
DS52  RGB_CA  [LED_1616_4P]  (value not drawn)
DS53  RGB_CA  [LED_1616_4P]  (value not drawn)
DS54  RGB_CA  [LED_1616_4P]  (value not drawn)
DS55  RGB_CA  [LED_1616_4P]  (value not drawn)
DS56  RGB_CA  [LED_1616_4P]  (value not drawn)
DS57  RGB_CA  [LED_1616_4P]  (value not drawn)
DS58  RGB_CA  [LED_1616_4P]  (value not drawn)
DS59  RGB_CA  [LED_1616_4P]  (value not drawn)
DS60  RGB_CA  [LED_1616_4P]  (value not drawn)
DS61  RGB_CA  [LED_1616_4P]  (value not drawn)
DS62  RGB_CA  [LED_1616_4P]  (value not drawn)
DS63  RGB_CA  [LED_1616_4P]  (value not drawn)
DS63a  RGB_CA  [LED_1616_4P]  (value not drawn)
DS64  RGB_CA  [LED_1616_4P]  (value not drawn)
DS64a  RGB_CA  [LED_1616_4P]  (value not drawn)
DS64b  RGB_CA  [LED_1616_4P]  (value not drawn)
DS65  RGB_CA  [LED_1616_4P]  (value not drawn)
DS65a  RGB_CA  [LED_1616_4P]  (value not drawn)
DS66  RGB_CA  [LED_1616_4P]  (value not drawn)
DS66a  RGB_CA  [LED_1616_4P]  (value not drawn)
DS66b  RGB_CA  [LED_1616_4P]  (value not drawn)
DS67  RGB_CA  [LED_1616_4P]  (value not drawn)
DS68  RGB_CA  [LED_1616_4P]  (value not drawn)
DS68a  RGB_CA  [LED_1616_4P]  (value not drawn)
DS68b  RGB_CA  [LED_1616_4P]  (value not drawn)
DS69  RGB_CA  [LED_1616_4P]  (value not drawn)
DS70  RGB_CA  [LED_1616_4P]  (value not drawn)
DS71  RGB_CA  [LED_1616_4P]  (value not drawn)
DS72  RGB_CA  [LED_1616_4P]  (value not drawn)
DS73  RGB_CA  [LED_1616_4P]  (value not drawn)
DS74  RGB_CA  [LED_1616_4P]  (value not drawn)
DS75  RGB_CA  [LED_1616_4P]  (value not drawn)
R2  100K  [Resistor_0603]
R3  100K  [Resistor_0603]
R4  50K  [Resistor_0603]
R5  100K  [Resistor_0603]
R6  100K  [Resistor_0603]
R7  50K  [Resistor_0603]
R8  1K  [Resistor_0603]
R9  1K  [Resistor_0603]
U1  IS31FL3733  [QFP_48_7mm_TP]
U2  IS31FL3733  [QFP_48_7mm_TP]

### Ports
SCL, SDA

### Nets
3V3: C1.2 C2.2 C3.2 C4.2 C5.2 C6.2 C7.2 C9.2 C10.2 C11.2 C12.2 C13.2 C14.2 C15.2 R2.2 R5.2 R8.2 R9.2 U1.20(PVCC) U1.29(PVCC) U1.37(AVCC) U1.38(DVCC) U1.39(VIO) U2.20(PVCC) U2.29(PVCC) U2.37(AVCC) U2.38(DVCC) U2.39(VIO)
GND: C1.1 C2.1 C3.1 C4.1 C5.1 C6.1 C7.1 C9.1 C10.1 C11.1 C12.1 C13.1 C14.1 C15.1 R3.2 R4.2 R6.2 R7.2 U1.5(PGND) U1.12(PGND) U1.34(AGND) U1.43(ADDR1) U1.44(ADDR2) U1.48(GND) U1.49(GND) U2.5(PGND) U2.12(PGND) U2.34(AGND) U2.44(ADDR2) U2.48(GND) U2.49(GND)
A_CS1: DS1.3 DS31.3 DS60.3 U1.19(CS4)
A_CS2: DS2.3 DS32.3 DS61.3 U1.21(CS5)
A_CS3: DS3.3 DS33.3 DS62.3 U1.22(CS6)
A_CS4: DS4.3 DS34.3 U1.23(CS7)
A_CS5: DS5.3 DS35.3 DS63.3 DS63a.3 U1.24(CS8)
A_CS6: DS6.3 DS36.3 U1.18(CS3)
A_CS7: DS7.3 DS37.3 DS64.3 DS64a.3 DS64b.3 U1.16(CS1)
A_CS8: DS8.3 DS38.3 U1.17(CS2)
A_CS9: DS16.3 DS45.3 DS75.3 U1.32(CS15)
A_CS10: DS17.3 DS46.3 DS74.3 U1.31(CS14)
A_CS11: DS18.3 DS47.3 U1.30(CS13)
A_CS12: DS19.3 DS48.3 U1.28(CS12)
A_CS13: DS20.3 DS49.3 U1.27(CS11)
A_CS14: DS21.3 DS50.3 U1.26(CS10)
A_CS15: DS22.3 DS51.3 U1.25(CS9)
A_CS16: DS23.3 DS52.3 U1.33(CS16)
A_SW1: DS1.1 DS2.1 DS3.1 DS4.1 DS5.1 DS6.1 DS7.1 DS8.1 DS16.1 DS17.1 DS18.1 DS19.1 DS20.1 DS21.1 DS22.1 DS23.1 U1.6(SW4)
A_SW2: DS1.2 DS2.2 DS3.2 DS4.2 DS5.2 DS6.2 DS7.2 DS8.2 DS16.2 DS17.2 DS18.2 DS19.2 DS20.2 DS21.2 DS22.2 DS23.2 U1.4(SW3)
A_SW3: DS1.4 DS2.4 DS3.4 DS4.4 DS5.4 DS6.4 DS7.4 DS8.4 DS16.4 DS17.4 DS18.4 DS19.4 DS20.4 DS21.4 DS22.4 DS23.4 U1.3(SW2)
A_SW4: DS31.1 DS32.1 DS33.1 DS34.1 DS35.1 DS36.1 DS37.1 DS38.1 DS45.1 DS46.1 DS47.1 DS48.1 DS49.1 DS50.1 DS51.1 DS52.1 U1.2(SW1)
A_SW5: DS31.2 DS32.2 DS33.2 DS34.2 DS35.2 DS36.2 DS37.2 DS38.2 DS45.2 DS46.2 DS47.2 DS48.2 DS49.2 DS50.2 DS51.2 DS52.2 U1.10(SW8)
A_SW6: DS31.4 DS32.4 DS33.4 DS34.4 DS35.4 DS36.4 DS37.4 DS38.4 DS45.4 DS46.4 DS47.4 DS48.4 DS49.4 DS50.4 DS51.4 DS52.4 U1.11(SW9)
A_SW7: DS60.1 DS61.1 DS62.1 DS63.1 DS63a.1 DS64.1 DS64a.1 DS64b.1 DS74.1 DS75.1 U1.9(SW7)
A_SW8: DS60.2 DS61.2 DS62.2 DS63.2 DS63a.2 DS64.2 DS64a.2 DS64b.2 DS74.2 DS75.2 U1.8(SW6)
A_SW9: DS60.4 DS61.4 DS62.4 DS63.4 DS63a.4 DS64.4 DS64a.4 DS64b.4 DS74.4 DS75.4 U1.7(SW5)
B_CS1: DS9.3 DS39.3 DS65.3 DS65a.3 U2.16(CS1)
B_CS2: DS10.3 DS40.3 DS66.3 DS66a.3 DS66b.3 U2.17(CS2)
B_CS3: DS11.3 DS41.3 DS67.3 U2.18(CS3)
B_CS4: DS12.3 DS42.3 DS68.3 DS68a.3 DS68b.3 U2.19(CS4)
B_CS5: DS13.3 DS43.3 DS69.3 U2.21(CS5)
B_CS6: DS14.3 DS70.3 U2.27(CS11)
B_CS7: DS15.3 DS44.3 DS71.3 U2.22(CS6)
B_CS8: DS24.3 DS53.3 U2.31(CS14)
B_CS9: DS25.3 DS54.3 U2.23(CS7)
B_CS10: DS26.3 DS55.3 U2.24(CS8)
B_CS11: DS27.3 DS56.3 U2.25(CS9)
B_CS12: DS28.3 DS57.3 U2.26(CS10)
B_CS13: DS29.3 DS58.3 DS72.3 U2.28(CS12)
B_CS14: DS30.3 DS59.3 DS73.3 U2.30(CS13)
B_SW1: DS9.1 DS10.1 DS11.1 DS12.1 DS13.1 DS14.1 DS15.1 DS24.1 DS25.1 DS26.1 DS27.1 DS28.1 DS29.1 DS30.1 U2.2(SW1)
B_SW2: DS9.2 DS10.2 DS11.2 DS12.2 DS13.2 DS14.2 DS15.2 DS24.2 DS25.2 DS26.2 DS27.2 DS28.2 DS29.2 DS30.2 U2.3(SW2)
B_SW3: DS9.4 DS10.4 DS11.4 DS12.4 DS13.4 DS14.4 DS15.4 DS24.4 DS25.4 DS26.4 DS27.4 DS28.4 DS29.4 DS30.4 U2.4(SW3)
B_SW4: DS39.1 DS40.1 DS41.1 DS42.1 DS43.1 DS44.1 DS53.1 DS54.1 DS55.1 DS56.1 DS57.1 DS58.1 DS59.1 U2.6(SW4)
B_SW5: DS39.2 DS40.2 DS41.2 DS42.2 DS43.2 DS44.2 DS53.2 DS54.2 DS55.2 DS56.2 DS57.2 DS58.2 DS59.2 U2.7(SW5)
B_SW6: DS39.4 DS40.4 DS41.4 DS42.4 DS43.4 DS44.4 DS53.4 DS54.4 DS55.4 DS56.4 DS57.4 DS58.4 DS59.4 U2.8(SW6)
B_SW7: DS65.1 DS65a.1 DS66.1 DS66a.1 DS66b.1 DS67.1 DS68.1 DS68a.1 DS68b.1 DS69.1 DS70.1 DS71.1 DS72.1 DS73.1 U2.9(SW7)
B_SW8: DS65.2 DS65a.2 DS66.2 DS66a.2 DS66b.2 DS67.2 DS68.2 DS68a.2 DS68b.2 DS69.2 DS70.2 DS71.2 DS72.2 DS73.2 U2.10(SW8)
B_SW9: DS65.4 DS65a.4 DS66.4 DS66a.4 DS66b.4 DS67.4 DS68.4 DS68a.4 DS68b.4 DS69.4 DS70.4 DS71.4 DS72.4 DS73.4 U2.11(SW9)
SCL: R8.1 U1.42(SCL) U2.42(SCL) U2.43(ADDR1) ; port SCL
SDA: R9.1 U1.41(SDA) U2.41(SDA) ; port SDA
SYNC: U1.40(SYNC) U2.40(SYNC)
NetR2_1: R2.1 U1.46(SDB)
NetR3_1: R3.1 U1.47(IICRST)
NetR4_1: R4.1 U1.35(RSET)
NetR5_1: R5.1 U2.46(SDB)
NetR6_1: R6.1 U2.47(IICRST)
NetR7_1: R7.1 U2.35(RSET)

Not connected (* = marked no-connect by the designer): U1 13(SW10)* 14(SW11)* 15(SW12)* 45(INTB)*; U2 13(SW10)* 14(SW11)* 15(SW12)* 32(CS15)* 33(CS16)* 45(INTB)*

### Library data of the parts
C1-C7 C9-C15 = Capacitor
R2-R9 = Resistor

## Sheet Bluetooth.SchDoc
size A4
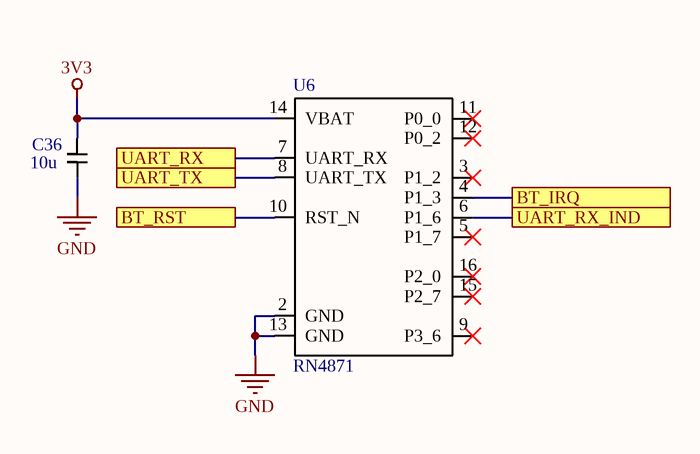
[diagram p4: Bluetooth.SchDoc]

### Parts
C36  10u  [Capacitor_0603]
U6  RN4871  [RN4871]

### Ports
BT_IRQ, BT_RST, UART_RX, UART_RX_IND, UART_TX

### Nets
3V3: C36.2 U6.14(VBAT)
GND: C36.1 U6.2(GND) U6.13(GND)
BT_IRQ: U6.4(P1_3) ; port BT_IRQ
UART_RX: U6.7(UART_RX) ; port UART_RX
UART_RX_IND: U6.6(P1_6) ; port UART_RX_IND
UART_TX: U6.8(UART_TX) ; port UART_TX
NetNT1_1: U6.10(RST_N) ; port BT_RST

Not connected (* = marked no-connect by the designer): U6 3(P1_2)* 5(P1_7)* 9(P3_6)* 11(P0_0)* 12(P0_2)* 15(P2_7)* 16(P2_0)*

### Library data of the parts
C36 = Capacitor

## Nets that join several sheets
3V3: Main (14 pins), Usb (6 pins), Lighting (28 pins), Bluetooth (C36.2 U6.14)
GND: Main (16 pins), Usb (35 pins), SwitchMatrix (5 pins), Lighting (31 pins), Bluetooth (C36.1 U6.2 U6.13)
BAT_CONNECT: Main (U5.42), Usb (Q3.1 R28.2)
BT_IRQ: Main (U5.10), Bluetooth (U6.4)
COL_1: Main (U5.39), SwitchMatrix (D16.A D31.A D45.A D60.A)
COL_2: Main (U5.38), SwitchMatrix (5 pins)
COL_3: Main (U5.46), SwitchMatrix (5 pins)
COL_4: Main (U5.45), SwitchMatrix (D4.A D19.A D34.A D48.A)
COL_5: Main (U5.41), SwitchMatrix (5 pins)
COL_6: Main (U5.15), SwitchMatrix (D6.A D21.A D36.A D50.A)
COL_7: Main (U5.16), SwitchMatrix (5 pins)
COL_8: Main (U5.17), SwitchMatrix (D8.A D23.A D38.A D52.A)
COL_9: Main (U5.28), SwitchMatrix (5 pins)
COL_10: Main (U5.27), SwitchMatrix (5 pins)
COL_11: Main (U5.26), SwitchMatrix (5 pins)
COL_12: Main (U5.25), SwitchMatrix (5 pins)
COL_13: Main (U5.20), SwitchMatrix (5 pins)
COL_14: Main (U5.19), SwitchMatrix (D14.A D29.A D58.A D70.A)
COL_15: Main (U5.18), SwitchMatrix (5 pins)
D_N: Main (U5.32), Usb (R22.2)
D_P: Main (U5.33), Usb (R20.2)
KEY_1: Main (U5.2), SwitchMatrix (S1.2)
NetNT1_1: Main (NT1.1 NT4.1), Bluetooth (U6.10)
ROW_1: Main (NT3.1), SwitchMatrix (14 pins)
ROW_2: Main (U5.40), SwitchMatrix (16 pins)
ROW_3: Main (U5.31), SwitchMatrix (15 pins)
ROW_4: Main (U5.29), SwitchMatrix (16 pins)
ROW_5: Main (U5.30), SwitchMatrix (21 pins)
SCL: Main (U5.21), Lighting (R8.1 U1.42 U2.42 U2.43)
SDA: Main (U5.22), Lighting (R9.1 U1.41 U2.41)
UART_RX: Main (U5.12), Bluetooth (U6.7)
UART_RX_IND: Main (U5.14), Bluetooth (U6.6)
UART_TX: Main (U5.13), Bluetooth (U6.8)
USB_IS_PRESENT: Main (U5.43), Usb (R24.1 R27.2)
USB_SET_CURRENT: Main (U5.3), Usb (NT6.1 R21.2 U3.4)
VBAT_SENSE: Main (U5.11), Usb (C26.2 R23.1 R26.2)